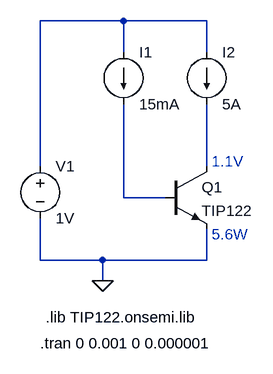
[diagram p0: schematic 5A.asc]
5A.asc, the LTspice schematic file:
Version 4
SHEET 1 880 680
WIRE 144 -96 16 -96
WIRE 272 -96 144 -96
WIRE 144 -48 144 -96
WIRE 272 -48 272 -96
WIRE 16 128 16 -96
WIRE 272 128 272 32
WIRE 144 176 144 32
WIRE 208 176 144 176
WIRE 16 272 16 208
WIRE 112 272 16 272
WIRE 272 272 272 224
WIRE 272 272 112 272
WIRE 112 304 112 272
FLAG 112 304 0
SYMBOL npn 208 128 R0
SYMATTR InstName Q1
SYMATTR Value TIP122
SYMATTR Prefix X
SYMBOL voltage 16 112 R0
SYMATTR InstName V1
SYMATTR Value 1V
SYMBOL current 144 -48 R0
SYMATTR InstName I1
SYMATTR Value 15mA
SYMBOL current 272 -48 R0
WINDOW 123 0 0 Left 2
WINDOW 39 0 0 Left 2
SYMATTR InstName I2
SYMATTR Value 5A
TEXT 24 360 Left 2 !.lib TIP122.onsemi.lib
TEXT 16 400 Left 2 !.tran 0 0.001 0 0.000001
TEXT 280 120 Left 2 ;1.1V
TEXT 280 232 Left 2 ;5.6W

The netlist it stands for:
* 5A.asc
XQ1 N002 N003 0 TIP122  ; pins C B E
V1 N001 0 1V
I1 N001 N003 15mA
I2 N001 N002 5A
.lib TIP122.onsemi.lib
.tran 0 0.001 0 0.000001
* 1.1V
* 5.6W
.backanno
.end